# Altium schematic sheet MCU.SchDoc
size A3; SheetNumber: 3; SheetTotal: 8
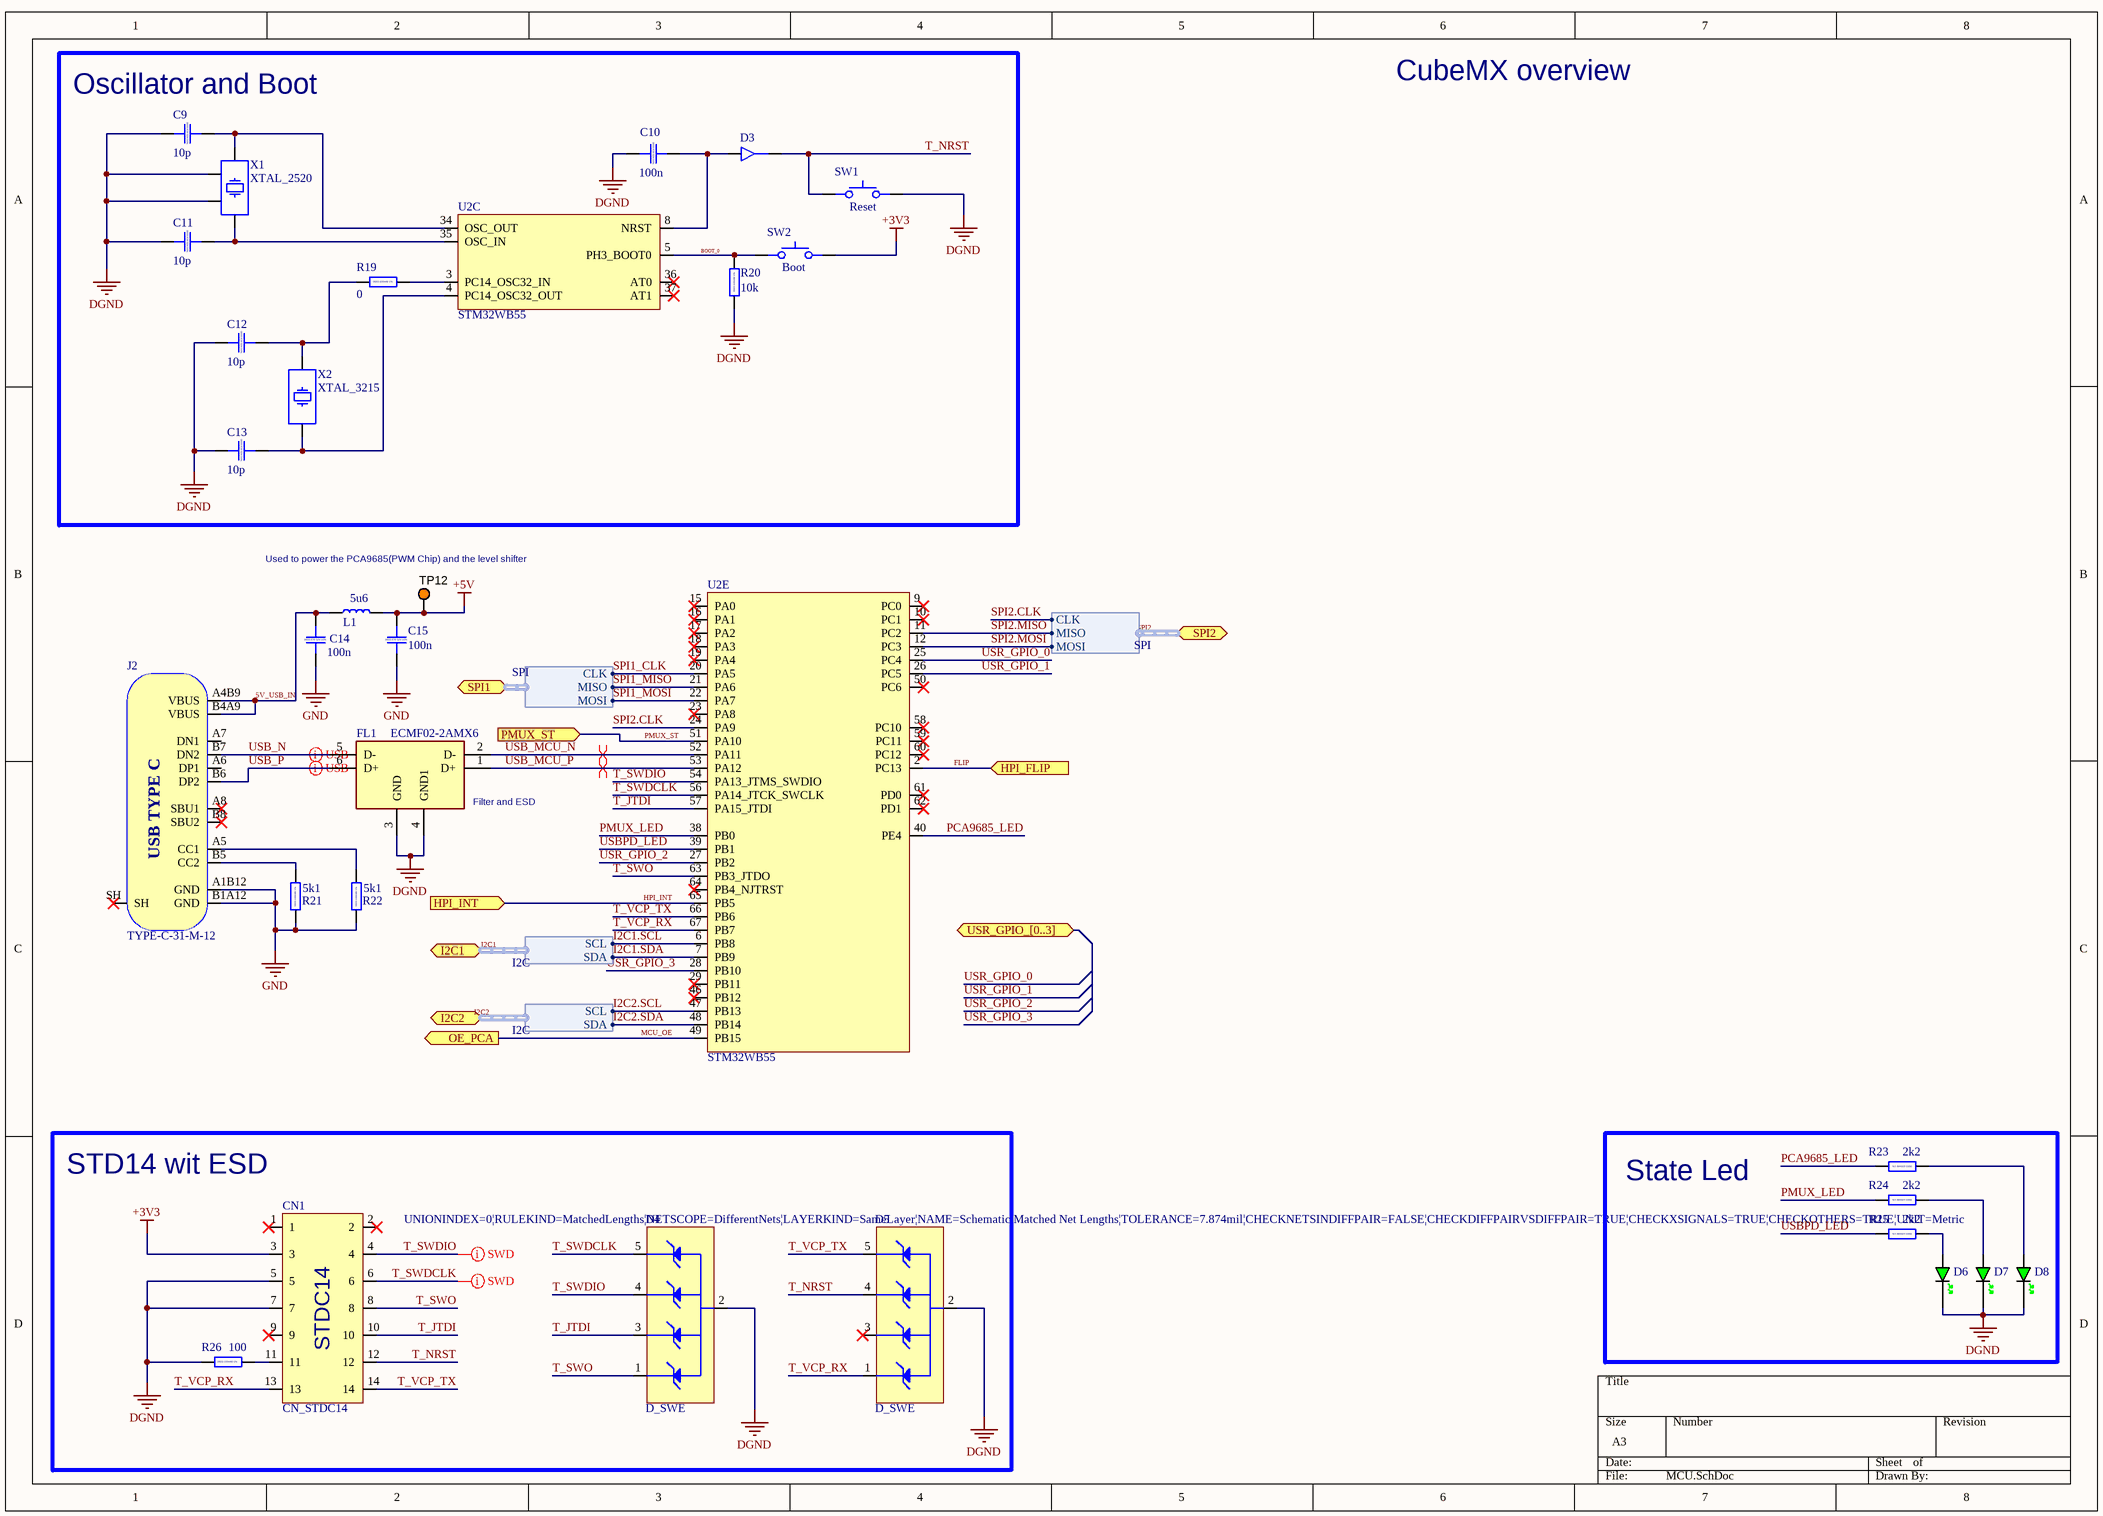
[diagram p0: MCU.SchDoc]

## Parts
C9  10p  [CAP_0603]
C10  100n  [CAP_0603]
C11  10p  [CAP_0603]
C12  10p  [CAP_0603]
C13  10p  [CAP_0603]
C14  100n  [CAP_0603]
C15  100n  [CAP_0603]
CN1  CN_STDC14  [FTSH-107-01-F-DV-K-P-TR-Footprint-1]
D3  D_SOD_323  [SOD-323]  (value not drawn)
D4  D_SWE  [SOT65P210X110-5N]
D5  D_SWE  [SOT65P210X110-5N]
D6  LED_0603_GREEN  [LED_0603_GREEN]  (value not drawn)
D7  LED_0603_GREEN  [LED_0603_GREEN]  (value not drawn)
D8  LED_0603_GREEN  [LED_0603_GREEN]  (value not drawn)
FL1  ECMF02-2AMX6  [FP-QFN-6L-IPC_A]
J2  TYPE-C-31-M-12  [TYPE-C-31-M-12]
L1  5u6  [IND_0603]
R19  0  [RES_0603]
R20  10k  [RES_0603]
R21  5k1  [RES_0603]
R22  5k1  [RES_0603]
R23  2k2  [RES_0603]
R24  2k2  [RES_0603]
R25  2k2  [RES_0603]
R26  100  [RES_0603]
SW1  Reset  [SKRPANE010]
SW2  Boot  [SKRPANE010]
TP12  5003  [KSTN-5003]  (value not drawn)
U2  STM32WB55  [QFN40P800X800X100_HS-69N]  (parts C,E of 5)
X1  XTAL_2520  [XTAL_2520]
X2  XTAL_3215  [XTAL_3215-2]

## Blocks framed on the sheet
Oscillator and Boot: C9-C13 D3 R19 R20 SW1 SW2 U2 X1 X2
STD14 wit ESD: CN1 D4 D5 R26
State Led: D6-D8 R23-R25

## Ports
HPI_FLIP (in), HPI_INT (in), I2C1 (bidir, harness I2C), I2C2 (bidir, harness I2C), OE_PCA (out), PMUX_ST (in), SPI1 (bidir, harness SPI), SPI2 (bidir, harness SPI), USR_GPIO_[0..3] (bidir)

## Harnesses
SPI: CLK, MISO, MOSI
I2C: SCL, SDA

## Nets
+3V3: CN1.3 SW2.34
+5V: C15.1 L1.2 TP12.1
DGND: C9.2 C10.2 C11.2 C12.2 C13.2 CN1.5 CN1.7 D4.2 D5.2 D6.K D7.K D8.K FL1.3(GND) FL1.4(GND1) R20.1 R26.1 SW1.34 X1.2 X1.4
GND: C14.2 C15.2 J2.A1B12(GND) J2.B1A12(GND) R21.1 R22.1
5V_USB_IN: C14.1 J2.A4B9(VBUS) J2.B4A9(VBUS) L1.1
BOOT_0: R20.2 SW2.12 U2.5(PH3_BOOT0)
FLIP: U2.2(PC13) ; port HPI_FLIP
HPI_INT: U2.65(PB5) ; port HPI_INT
I2C1.SCL: U2.6(PB8) ; port I2C1.SCL
I2C1.SDA: U2.7(PB9) ; port I2C1.SDA
I2C2.SCL: U2.47(PB13) ; port I2C2.SCL
I2C2.SDA: U2.48(PB14) ; port I2C2.SDA
MCU_OE: U2.49(PB15) ; port OE_PCA
PCA9685_LED: R23.2 U2.40(PE4)
PMUX_LED: R24.2 U2.38(PB0)
PMUX_ST: U2.51(PA10) ; port PMUX_ST
SPI1_CLK: U2.20(PA5) ; port SPI1.CLK
SPI1_MISO: U2.21(PA6) ; port SPI1.MISO
SPI1_MOSI: U2.22(PA7) ; port SPI1.MOSI
SPI2.CLK: U2.24(PA9) ; port SPI2.CLK
SPI2.MISO: U2.11(PC2) ; port SPI2.MISO
SPI2.MOSI: U2.12(PC3) ; port SPI2.MOSI
T_JTDI: CN1.10 D4.3 U2.57(PA15_JTDI)
T_NRST: CN1.12 D3.K D5.4 SW1.12
T_SWDCLK: CN1.6 D4.5 U2.56(PA14_JTCK_SWCLK)
T_SWDIO: CN1.4 D4.4 U2.54(PA13_JTMS_SWDIO)
T_SWO: CN1.8 D4.1 U2.63(PB3_JTDO)
T_VCP_RX: CN1.13 D5.1 U2.67(PB7)
T_VCP_TX: CN1.14 D5.5 U2.66(PB6)
USB_MCU_N: FL1.2(D-) U2.52(PA11)
USB_MCU_P: FL1.1(D+) U2.53(PA12)
USB_N: FL1.5(D-) J2.B7(DN2)
USB_P: FL1.6(D+) J2.B6(DP2)
USBPD_LED: R25.2 U2.39(PB1)
USR_GPIO_0: U2.25(PC4)
USR_GPIO_1: U2.26(PC5)
USR_GPIO_2: U2.27(PB2)
USR_GPIO_3: U2.28(PB10)
NetC9_1: C9.1 U2.34(OSC_OUT) X1.1
NetC10_1: C10.1 D3.A U2.8(NRST)
NetC11_1: C11.1 U2.35(OSC_IN) X1.3
NetC12_1: C12.1 R19.1 X2.2
NetC13_1: C13.1 U2.4(PC14_OSC32_OUT) X2.1
NetCN1_11: CN1.11 R26.2
NetD6_A: D6.A R25.1
NetD7_A: D7.A R24.1
NetD8_A: D8.A R23.1
NetJ2_A5: J2.A5(CC1) R22.2
NetJ2_B5: J2.B5(CC2) R21.2
NetR19_2: R19.2 U2.3(PC14_OSC32_IN)

Not connected (* = marked no-connect by the designer): CN1 1* 2* 9*; D5 3*; J2 A6(DP1) A7(DN1) A8(SBU1)* B8(SBU2)* SH*; U2 9(PC0)* 10(PC1)* 15(PA0)* 16(PA1)* 17(PA2)* 18(PA3)* 19(PA4)* 23(PA8)* 29(PB11)* 36(AT0)* 37(AT1)* 46(PB12)* 50(PC6)* 58(PC10)* 59(PC11)* 60(PC12)* 61(PD0)* 62(PD1)* 64(PB4_NJTRST)*

## Buses and harness runs
harness I2C1 = port I2C1
harness I2C2 = port I2C2
harness SPI2 = port SPI2

## Layout directives
differential pair; differential pair class DIFF_USB: USB_MCU_N, USB_MCU_P, USB_N, USB_P
rule Matched Net Lengths [Tolerance = 0.2mm]; net class SWDIO: T_SWDCLK, T_SWDIO

## Notes on the sheet
- CubeMX overview
- Used to power the PCA9685(PWM Chip) and the level shifter
- (near FL1) Filter and ESD
- (in symbol CMP-001-00113-3) 0603 X7R 50V 10%
- (in symbol CMP-002-00119-1) USB TYPE C
- (in symbol CMP-002-00331-1) STDC14
- (in symbol CMP-009-00179-5) 0603 100mW 1%

## Library data of the parts
C9-C15 = CMP-001-00113-3: Capacitor SMD 0603; Manufacturer: *; Rating: *; Distributor Link: *; Source: Schematic-Lib-PhilsLab.SchLib; Manufacturer Part Number: *; Dielectric: *; LCSC: *; Design Item ID: CAP_0603
  C9 C11-C13: Value: 10p
  C10 C14 C15: Value: 100n
CN1 = CMP-002-00331-1: Board Connector, 14 Contact(s), 2 Row(s), Male, Straight, 0.05 inch Pitch, Surface Mount Terminal, Locking; RoHS Compliant: Yes; Mounting Technology: Board; Connector Type: BOARD CONNECTOR
D3 = CMP-004-00140-1: Diode SMD SOD-323; Source: Schematic-Lib-PhilsLab.SchLib; Design Item ID: D_SOD_323
D4 D5 = CMP-004-00138-2: ESDALC6V1W5 Trans Voltage Suppressor Diode, 25W, Unidirectional, 4 Element, Silicon; Pins: 5; RoHS Compliant: Yes; Max Operating Temperature: 150°C
D6-D8 = CMP-004-00051-1: LED 0603 GREEN SMD; Source: Schematic-Lib-PhilsLab.SchLib; Design Item ID: LED_0603_GREEN
FL1 = CMP-031-00232-5: Data Line Filter, 2 Function(s), 6 Pin(s), Plastic; Max Operating Temperature: 85°C; Min Operating Temperature: -40°C; Mounting Technology: Surface Mount; RoHS Compliant: Yes; Pins: 6
J2 = CMP-002-00119-1: USB Type C Connector Horizontal SMT; Manufacturer: Koren Hroparts; Source: Schematic-Lib-PhilsLab.SchLib; Manufacturer Part Number: TYPE-C-31-M-12; Design Item ID: TYPE-C-31-M-12
L1 = CMP-006-00026-1: Inductor SMD 0603; Design Item ID: IND_0603; Source: Schematic-Lib-PhilsLab.SchLib
R19-R26 = CMP-009-00179-5: Resistor 0603 100mW 1%; LCSC: *; Distributor Link: *; Manufacturer Part Number: *; Design Item ID: RES_0603; Manufacturer: *; Source: Schematic-Lib-PhilsLab.SchLib
  R19: Value: 0
  R20: Value: 10k
  R21 R22: Value: 5k1
  R23-R25: Value: 2k2
  R26: Value: 100
SW1 SW2 = CMP-011-00019-1: Tactile Switch SMD SPST; Manufacturer: Alps Alpine; Manufacturer Part Number: SKRPANE010; Source: Schematic-Lib-PhilsLab.SchLib; Design Item ID: SKRPANE010
TP12 = CMP-002-00037-2: Test Point, Orange, Height 4.6 mm, Tail Length 3 mm, 1-Pin THD, RoHS; Manufacturer: Keystone; Colour: Orange; Packaging: Bulk; Package Description: 1-Pin Through Hole Device, Dia 2.54 mm; Pins: 1; Package Reference: 5003; Datasheet Version: Jun-15; Case/Package: 5003; Mounting Technology: TH; Connector Type: TestPoint; Diameter: 2.54mm; Contact Material: Bronze; Datasheet URL: http://keyelco.com/userAssets/file/M65p56.pdf; Manufacturer URL: http://www.keyelco.com/; Package Quantity: 10; Contact Plating: Tin; RoHS Compliant: True
U2 = CMP-031-00230-3: Multiprotocol wireless 32-bit MCU Arm®-based Cortex®-M4
X1 = CMP-003-00031-1: Crystal SMD 2520; Distributor Link: *; Design Item ID: XTAL_2520; Source: Schematic-Lib-PhilsLab.SchLib
X2 = CMP-003-00032-1: Crystal SMD 3215; Source: Schematic-Lib-PhilsLab.SchLib; Distributor Link: *; Design Item ID: XTAL_3215